# Altium schematic sheet mbed_programmer_lpc11u35.SchDoc: mbed_programmer
size 298 x 212 mm; Date: 10.06.2016 15:21:41; SheetNumber: 1
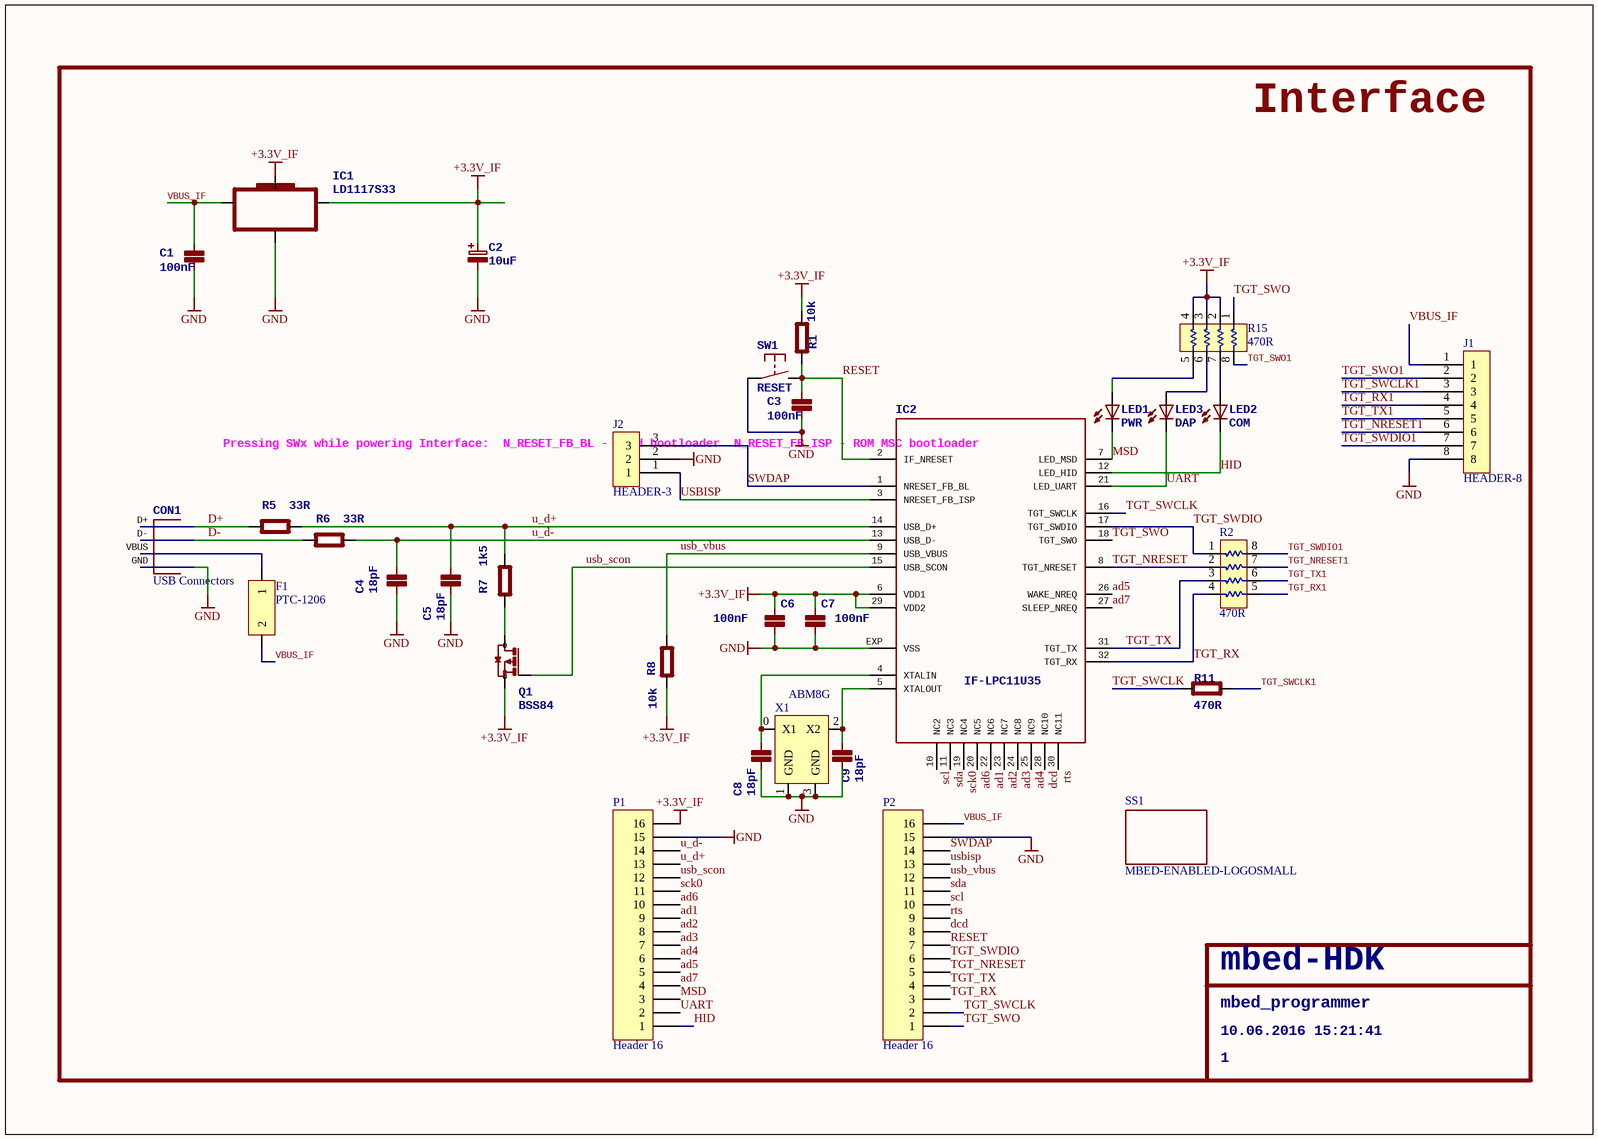
[diagram p0: mbed_programmer_lpc11u35.SchDoc]

## Parts
C1  100nF  [0603]
C2  10uF  [CASE-B]
C3  100nF  [0603]
C4  18pF  [0603]
C5  18pF  [0603]
C6  100nF  [0603]
C7  100nF  [0603]
C8  18pF  [0603]
C9  18pF  [0603]
CON1  USB Connectors  [MOLEX-47364-0001]
F1  PTC-1206  [PTC-1206]
IC1  LD1117S33  [SOT223]
IC2  IF-LPC11U35  [QFN50P500X500X85_HS-33N]
J1  HEADER-8  [MICRO-MATCH-8]
J2  HEADER-3  [PIN-HEADER-3]
LED1  PWR  [CHIPLED_0603]
LED2  COM  [CHIPLED_0603]
LED3  DAP  [CHIPLED_0603]
P1  Header 16  [HDR1X16]
P2  Header 16  [HDR1X16]
Q1  BSS84  [SOT23]
R1  10k  [0603]
R2  470R  [CAC-80P319X159-8N]
R5  33R  [0603]
R6  33R  [0603]
R7  1k5  [0603]
R8  10k  [0603]
R11  470R  [0603]
R15  470R  [CAC-80P319X159-8N]
SS1  MBED-ENABLED-LOGOSMALL  [MBED-ENABLED-LOGO-250X250-MIL]
SW1  RESET  [DTSM-32S-B]
X1  ABM8G  [XTAL-3.2x2.5]

## Nets
+3.3V_IF: C2.1 C6.1(P$1) C7.1(P$1) IC1.2(OUT) IC1.4(K) IC2.6(VDD1) IC2.29(VDD2) P1.16 Q1.2(S) R1.2(P$2) R8.2(P$2) R15.2 R15.3 R15.4
GND: C1.2(P$2) C2.2 C3.2(P$2) C4.2(P$2) C5.2(P$2) C6.2(P$2) C7.2(P$2) C8.2(P$2) C9.2(P$2) CON1.GND IC1.1(GND) IC2.EXP(VSS) J1.8 J2.2 P1.15 P2.15 SW1.P$1(P) X1.1(GND) X1.3(GND)
ad1: IC2.22(NC6) P1.9
ad2: IC2.23(NC7) P1.8
ad3: IC2.24(NC8) P1.7
ad4: IC2.25(NC9) P1.6
ad5: IC2.26(WAKE_NREQ) P1.5
ad6: IC2.20(NC5) P1.10
ad7: IC2.27(SLEEP_NREQ) P1.4
D+: CON1.D+ R5.1(P$1)
D-: CON1.D- R6.1(P$1)
dcd: IC2.28(NC10) P2.8
HID: IC2.12(LED_HID) LED2.C P1.1
MSD: IC2.7(LED_MSD) LED1.C P1.3
RESET: C3.1(P$1) IC2.2(IF_NRESET) P2.7 R1.1(P$1) SW1.P$2(S)
rts: IC2.30(NC11) P2.9
sck0: IC2.19(NC4) P1.11
scl: IC2.10(NC2) P2.10
sda: IC2.11(NC3) P2.11
SWDAP: IC2.1(NRESET_FB_BL) J2.3 P2.14
TGT_NRESET: IC2.8(TGT_NRESET) P2.5 R2.2
TGT_NRESET1: J1.6 R2.7
TGT_RX: IC2.32(TGT_RX) P2.3 R2.4
TGT_RX1: J1.4 R2.5
TGT_SWCLK: IC2.16(TGT_SWCLK) P2.2 R11.2(P$2)
TGT_SWCLK1: J1.3 R11.1(P$1)
TGT_SWDIO: IC2.17(TGT_SWDIO) P2.6 R2.1
TGT_SWDIO1: J1.7 R2.8
TGT_SWO: IC2.18(TGT_SWO) P2.1 R15.1
TGT_SWO1: J1.2 R15.8
TGT_TX: IC2.31(TGT_TX) P2.4 R2.3
TGT_TX1: J1.5 R2.6
u_d+: C5.1(P$1) IC2.14(USB_D+) P1.13 R5.2(P$2) R7.2(P$2)
u_d-: C4.1(P$1) IC2.13(USB_D-) P1.14 R6.2(P$2)
UART: IC2.21(LED_UART) LED3.C P1.2
usb_scon: IC2.15(USB_SCON) P1.12 Q1.1(G)
usb_vbus: IC2.9(USB_VBUS) P2.12 R8.1(P$1)
USBISP: IC2.3(NRESET_FB_ISP) J2.1 P2.13
VBUS_IF: C1.1(P$1) F1.2 IC1.3(IN) J1.1 P2.16
NetC8_1: C8.1(P$1) IC2.4(XTALIN) X1.0(X1)
NetC9_1: C9.1(P$1) IC2.5(XTALOUT) X1.2(X2)
NetCON1_VBUS: CON1.VBUS F1.1
NetLED1_A: LED1.A R15.5
NetLED2_A: LED2.A R15.7
NetLED3_A: LED3.A R15.6
NetQ1_3: Q1.3(D) R7.1(P$1)

## Notes on the sheet
- Interface
- (near J2) Pressing SWx while powering Interface:
  N_RESET_FB_BL - mbed bootloader
  N_RESET_FB_ISP - ROM MSC bootloader
- mbed_programmer
- mbed-HDK
- 10.06.2016 15:21:41
- 1

## Library data of the parts
C1 C3-C9 = C0603
C2 = C-POLB
CON1 = USB_MICROB
LED1-LED3 = LED0603
P1 P2 = Header 16: Header, 16-Pin; LatestRevisionDate: 17-Jul-2002; LatestRevisionNote: Re-released for DXP Platform.; Publisher: Altium Limited
R1 R5-R8 R11 = R0603
R2 R15 = 0603x4_resistor_array
SW1 = SPST